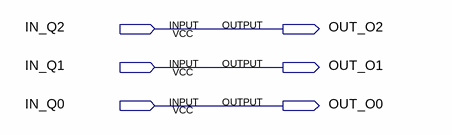
[diagram p0: schematic sheet]
// Quartus schematic FuncionDeSalida.bdf as structural Verilog: 0 symbols, 6 pins
module FuncionDeSalida (
  input  IN_Q2,
  input  IN_Q1,
  input  IN_Q0,
  output OUT_O2,
  output OUT_O1,
  output OUT_O0
);


  assign OUT_O0 = IN_Q0;
  assign OUT_O1 = IN_Q1;
  assign OUT_O2 = IN_Q2;
endmodule
